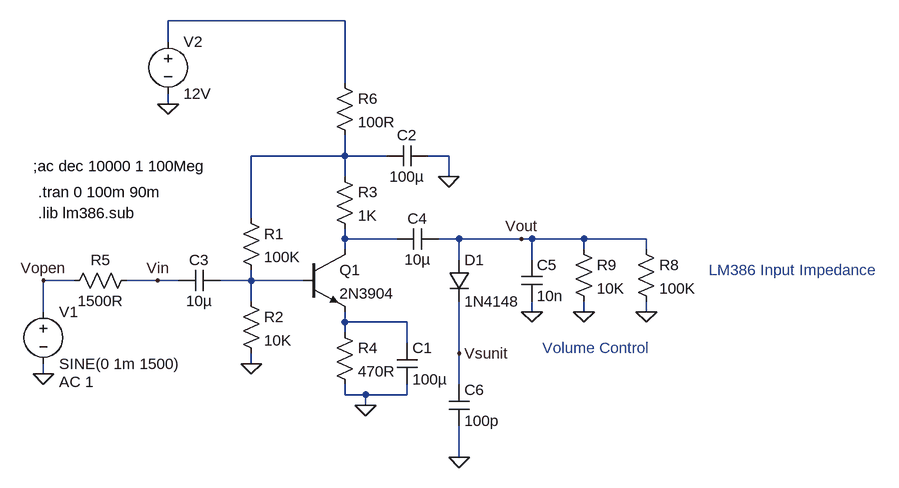
[diagram p0: schematic AudioPreamp.asc]
AudioPreamp.asc, the LTspice schematic file:
Version 4
SHEET 1 1096 680
WIRE 224 -224 -48 -224
WIRE -48 -192 -48 -224
WIRE 224 -128 224 -224
WIRE -48 -96 -48 -112
WIRE 224 -16 224 -48
WIRE 224 -16 80 -16
WIRE 288 -16 224 -16
WIRE 384 -16 352 -16
WIRE 224 16 224 -16
WIRE 384 16 384 -16
WIRE 80 80 80 -16
WIRE 224 112 224 96
WIRE 304 112 224 112
WIRE 400 112 368 112
WIRE 496 112 400 112
WIRE 512 112 496 112
WIRE 592 112 512 112
WIRE 688 112 592 112
WIRE 224 128 224 112
WIRE 592 128 592 112
WIRE 688 128 688 112
WIRE 400 144 400 112
WIRE 512 144 512 112
WIRE -192 176 -240 176
WIRE -64 176 -112 176
WIRE -32 176 -64 176
WIRE 80 176 80 160
WIRE 80 176 32 176
WIRE 160 176 80 176
WIRE 80 208 80 176
WIRE -240 224 -240 176
WIRE 512 224 512 208
WIRE 592 224 592 208
WIRE 688 224 688 208
WIRE 224 240 224 224
WIRE 320 240 224 240
WIRE 224 256 224 240
WIRE 320 272 320 240
WIRE 400 288 400 208
WIRE 80 304 80 288
WIRE -240 320 -240 304
WIRE 400 336 400 288
WIRE 224 352 224 336
WIRE 256 352 224 352
WIRE 320 352 320 336
WIRE 320 352 256 352
WIRE 256 368 256 352
WIRE 400 448 400 400
FLAG -48 -96 0
FLAG -240 320 0
FLAG 80 304 0
FLAG 256 368 0
FLAG 384 16 0
FLAG 512 224 0
FLAG -240 176 Vopen
FLAG -64 176 Vin
FLAG 496 112 Vout
FLAG 688 224 0
FLAG 592 224 0
FLAG 400 448 0
FLAG 400 288 Vsunit
SYMBOL npn 160 128 R0
SYMATTR InstName Q1
SYMATTR Value 2N3904
SYMBOL res 64 64 R0
SYMATTR InstName R1
SYMATTR Value 100K
SYMBOL res 64 192 R0
SYMATTR InstName R2
SYMATTR Value 10K
SYMBOL res 208 0 R0
SYMATTR InstName R3
SYMATTR Value 1K
SYMBOL res 208 240 R0
SYMATTR InstName R4
SYMATTR Value 470R
SYMBOL cap 304 272 R0
SYMATTR InstName C1
SYMATTR Value 100µ
SYMBOL cap 352 -32 R90
WINDOW 0 0 32 VBottom 2
WINDOW 3 32 32 VTop 2
SYMATTR InstName C2
SYMATTR Value 100µ
SYMBOL cap 32 160 R90
WINDOW 0 0 32 VBottom 2
WINDOW 3 32 32 VTop 2
SYMATTR InstName C3
SYMATTR Value 10µ
SYMBOL voltage -240 208 R0
WINDOW 123 24 124 Left 2
WINDOW 39 0 0 Left 2
SYMATTR Value2 AC 1
SYMATTR InstName V1
SYMATTR Value SINE(0 1m 1500)
SYMBOL voltage -48 -208 R0
WINDOW 123 0 0 Left 2
WINDOW 39 0 0 Left 2
SYMATTR InstName V2
SYMATTR Value 12V
SYMBOL res -96 160 R90
WINDOW 0 0 56 VBottom 2
WINDOW 3 32 56 VTop 2
SYMATTR InstName R5
SYMATTR Value 1500R
SYMBOL res 208 -144 R0
SYMATTR InstName R6
SYMATTR Value 100R
SYMBOL cap 368 96 R90
WINDOW 0 0 32 VBottom 2
WINDOW 3 32 32 VTop 2
SYMATTR InstName C4
SYMATTR Value 10µ
SYMBOL cap 496 144 R0
SYMATTR InstName C5
SYMATTR Value 10n
SYMBOL res 672 112 R0
SYMATTR InstName R8
SYMATTR Value 100K
SYMBOL res 576 112 R0
SYMATTR InstName R9
SYMATTR Value 10K
SYMBOL diode 384 144 R0
SYMATTR InstName D1
SYMATTR Value 1N4148
SYMBOL cap 384 336 R0
SYMATTR InstName C6
SYMATTR Value 100p
TEXT -248 40 Left 2 !.tran 0 100m 90m
TEXT -248 72 Left 2 !.lib lm386.sub
TEXT 784 160 Left 2 ;LM386 Input Impedance
TEXT 528 280 Left 2 ;Volume Control
TEXT -256 0 Left 2 !;ac dec 10000 1 100Meg

The netlist it stands for:
* AudioPreamp.asc
Q1 N003 N004 N005 0 2N3904
R1 N002 N004 100K
R2 N004 0 10K
R3 N002 N003 1K
R4 N005 0 470R
C1 N005 0 100µ
C2 0 N002 100µ
C3 N004 Vin 10µ
V1 Vopen 0 SINE(0 1m 1500) AC 1
V2 N001 0 12V
R5 Vin Vopen 1500R
R6 N001 N002 100R
C4 Vout N003 10µ
C5 Vout 0 10n
R8 Vout 0 100K
R9 Vout 0 10K
D1 Vout Vsunit 1N4148
C6 Vsunit 0 100p
.model D D
.lib standard.dio
.model NPN NPN
.model PNP PNP
.lib standard.bjt
.tran 0 100m 90m
.lib lm386.sub
* LM386 Input Impedance
* Volume Control
;ac dec 10000 1 100Meg
.backanno
.end